# EAGLE design Sensor Circuit (EAGLE 9.3.0)
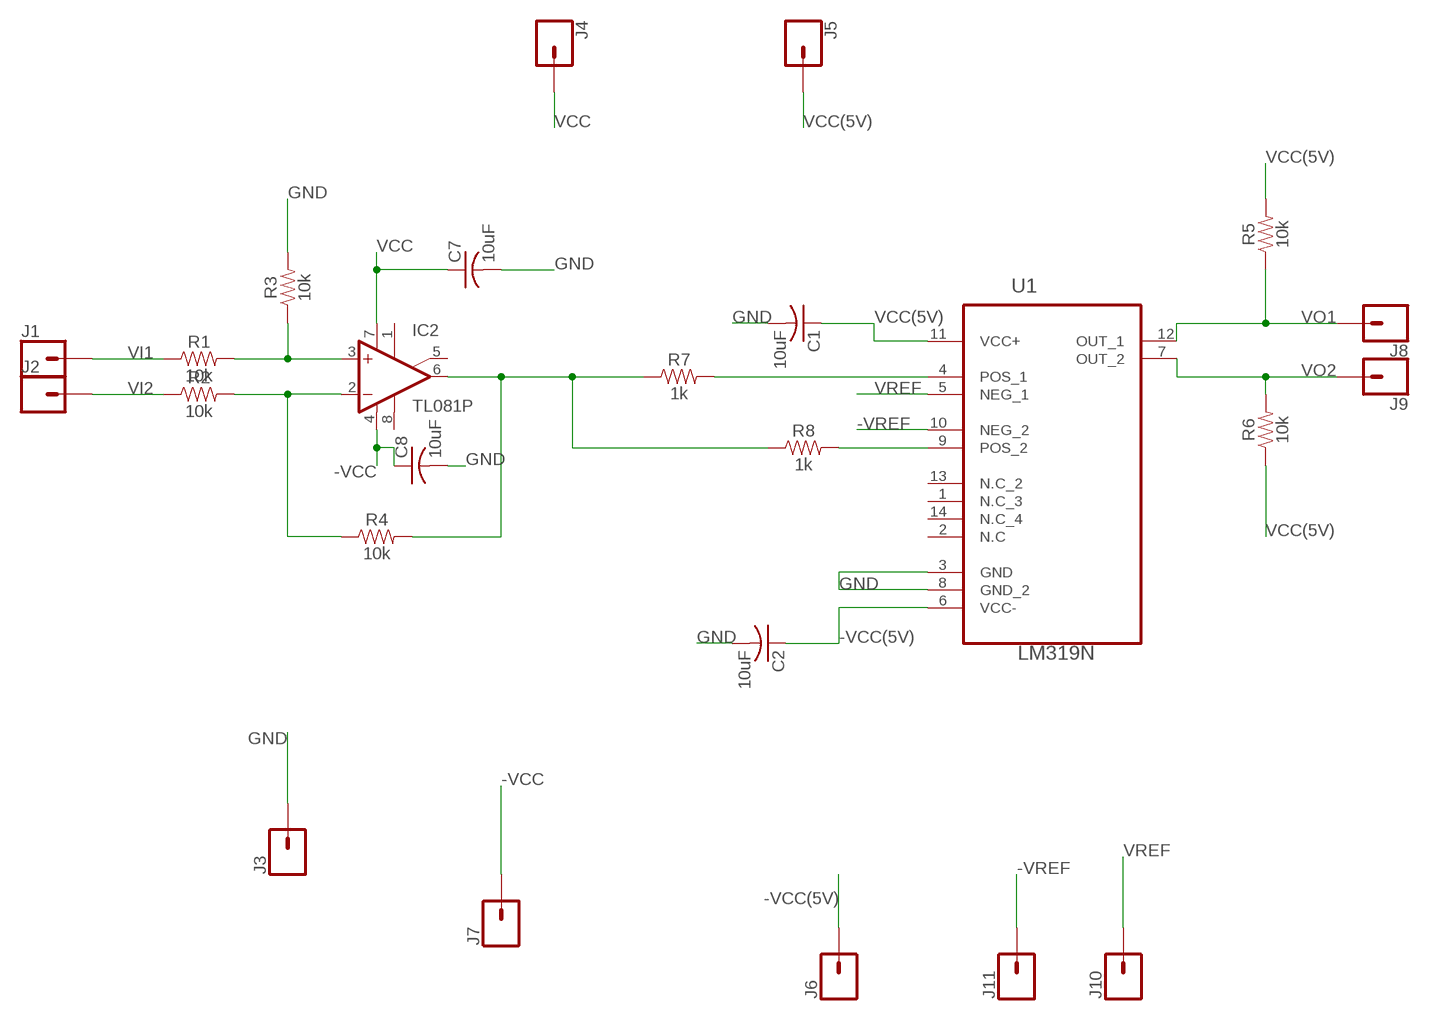
[diagram p0: schematic, sheet 1]

## Parts
C1  10uF  C-US050-024X044  [C050-024X044]
C2  10uF  C-US050-024X044  [C050-024X044]
C7  10uF  C-US050-024X044  [C050-024X044]
C8  10uF  C-US050-024X044  [C050-024X044]
IC2  TL081P  [DIL08]
J1  CONN_01  [1X01]
J2  CONN_01  [1X01]
J3  CONN_01  [1X01]
J4  CONN_01  [1X01]
J5  CONN_01  [1X01]
J6  CONN_01  [1X01]
J7  CONN_01  [1X01]
J8  CONN_01  [1X01]
J9  CONN_01  [1X01]
J10  CONN_01  [1X01]
J11  CONN_01  [1X01]
R1  10k  10KOHM-HORIZ-1/4W-1%  [AXIAL-0.3]
R2  10k  10KOHM-HORIZ-1/4W-1%  [AXIAL-0.3]
R3  10k  10KOHM-HORIZ-1/4W-1%  [AXIAL-0.3]
R4  10k  10KOHM-HORIZ-1/4W-1%  [AXIAL-0.3]
R5  10k  10KOHM-HORIZ-1/4W-1%  [AXIAL-0.3]
R6  10k  10KOHM-HORIZ-1/4W-1%  [AXIAL-0.3]
R7  1k  1KOHM-HORIZ-1/4W-1%  [AXIAL-0.3]
R8  1k  1KOHM-HORIZ-1/4W-1%  [AXIAL-0.3]
U1  LM319N  [DIP254P762X510-14]

## Nets
-VCC: C8.1 IC2.4(V-) J7.1
-VCC(5V): C2.1 J6.1 U1.6(VCC-)
-VREF: J11.1 U1.10(NEG_2)
GND: C1.2 C2.2 C7.2 C8.2 J3.1 R3.P$2 U1.3(GND) U1.8(GND_2)
N$1: IC2.2(-IN) R2.P$2 R4.P$1
N$2: IC2.6(OUT) R4.P$2 R7.P$1 R8.P$1
N$3: IC2.3(+IN) R1.P$2 R3.P$1
N$4: R8.P$2 U1.9(POS_2)
N$6: R7.P$2 U1.4(POS_1)
VCC: C7.1 IC2.7(V+) J4.1
VCC(5V): C1.1 J5.1 R5.P$2 R6.P$1 U1.11(VCC+)
VI1: J1.1 R1.P$1
VI2: J2.1 R2.P$1
VO1: J8.1 R5.P$1 U1.12(OUT_1)
VO2: J9.1 R6.P$2 U1.7(OUT_2)
VREF: J10.1 U1.5(NEG_1)
Unconnected: IC2.1(ON1) IC2.5(ON2) IC2.8(OPT) U1.1(N.C_3) U1.2(N.C) U1.13(N.C_2) U1.14(N.C_4)

## Library data of the parts
C1 C2 C7 C8 = rcl:C-US: CAPACITOR, American symbol; SPICEPREFIX: C
IC2 = TL081:TL081: OP AMP; AVAILABILITY: Unavailable; DESCRIPTION: the tl08x jfet-input operational amplifier family is designed to offer a wider selection than any previously develope...; MF: Texas Instruments; MP: TL081; PACKAGE: None; PRICE: None
J1-J11 = SparkFun-Connectors:CONN_01: Single connection point. Often used as Generic Header-pin footprint for 0.1 inch spaced/style header connections On any of the 0.1 inch spaced packages, you can populate with these: Break Away Headers - Straight <https://www.sparkfun.com/products/116> (PRT-00116) Break Away Male Headers - Right Angle <https://www.sparkfun.com/products/553> (PRT-00553) Female Headers <https://www.sparkfun.com/products/115> (PRT-00115) Break Away Headers - Machine Pin <https://www.sparkfun.com/products/117> (PRT-00117) Break Away Female Headers - Swiss Machine Pin <https://www.sparkfun.com/products/743> (PRT-00743) This device is also useful as a general connection point to wire up your design to another part of your project. Our various solder wires solder well into these plated through hole pads. Hook-Up Wire - Assortment (Stranded, 22 AWG) <https://www.sparkfun.com/products/11375> (PRT-11375) Hook-Up Wire - Assortment (Solid Core, 22 AWG) <https://www.sparkfun.com/products/11367> (PRT-11367) View the entire wire category on our website here <https://www.sparkfun.com/categories/141> Special notes: SMTSO-256-ET is a "flush mount" nut for a 4-40 screw. We mostly use this on specialty testbeds; it is a nice way to connect hardware to your PCB at an adjustable hieght. Also note, the SNAP packages are for using a snappable style connector. We sell a baggie of snaps and they are also used on two LilyPad designs: Snap Assortment - 30 pack (male and female) <https://www.sparkfun.com/products/11347> (DEV-11347) LilyPad Arduino SimpleSnap <https://www.sparkfun.com/products/10941> (DEV-10941) LilyPad SimpleSnap Protoboard <https://www.sparkfun.com/products/10940> (DEV-10940)
R1-R6 = SparkFun-Resistors:10KOHM: 10kΩ resistor A resistor is a passive two-terminal electrical component that implements electrical resistance as a circuit element. Resistors act to reduce current flow, and, at the same time, act to lower voltage levels within circuits. - Wikipedia; PROD_ID: RES-12183
R7 R8 = SparkFun-Resistors:1KOHM: 1kΩ resistor A resistor is a passive two-terminal electrical component that implements electrical resistance as a circuit element. Resistors act to reduce current flow, and, at the same time, act to lower voltage levels within circuits. - Wikipedia; PROD_ID: RES-12182
U1 = LM319N:LM319N: High speed dual comparators; AVAILABILITY: Unavailable; DESCRIPTION: Comparator; fast; 80ns; 5÷36VDC; Channels: 2; THT; DIP14; MF: Texas Instruments; MP: LM319N/NOPB; PACKAGE: DIP-14 Texas Instruments; PRICE: None

## Board
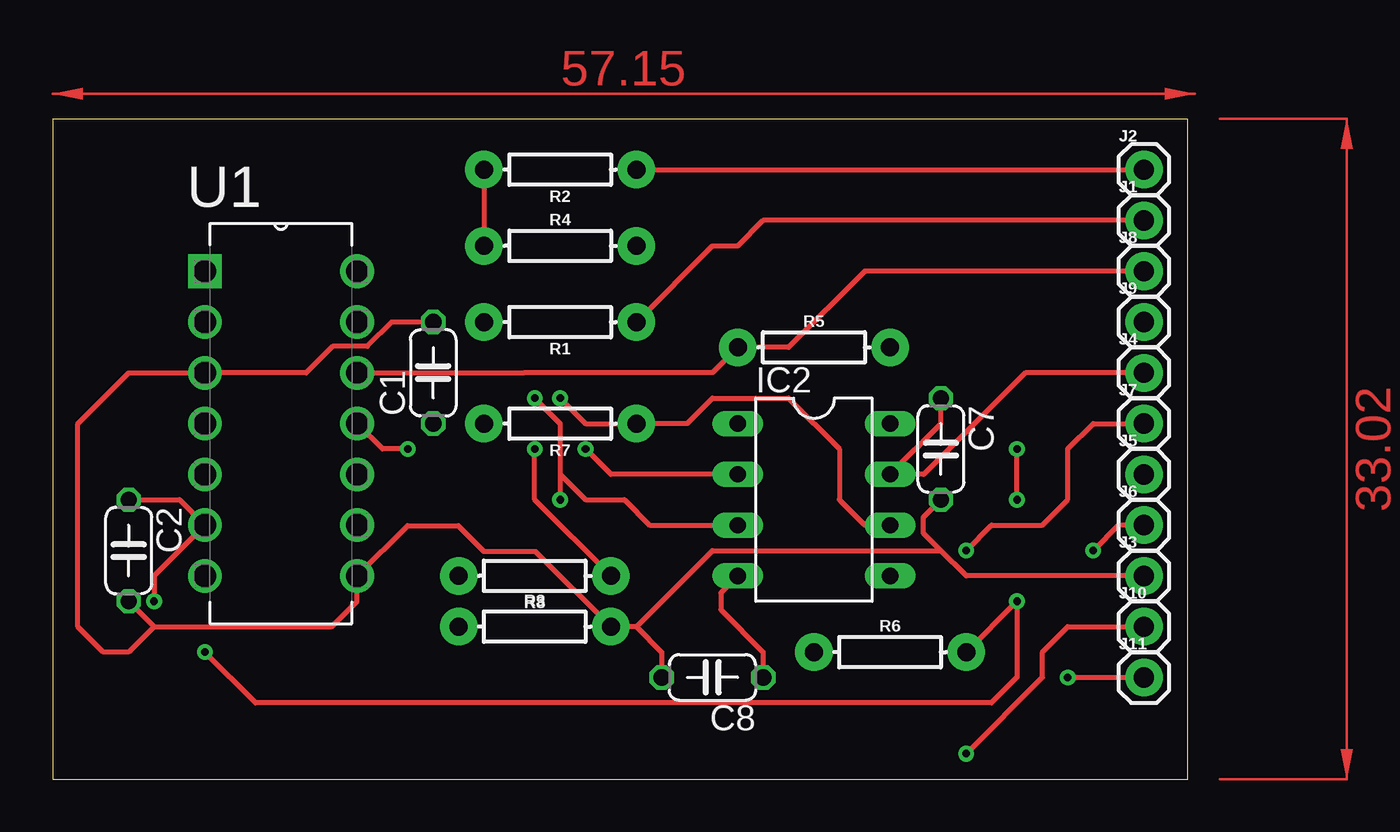
[diagram p1: board, top side]
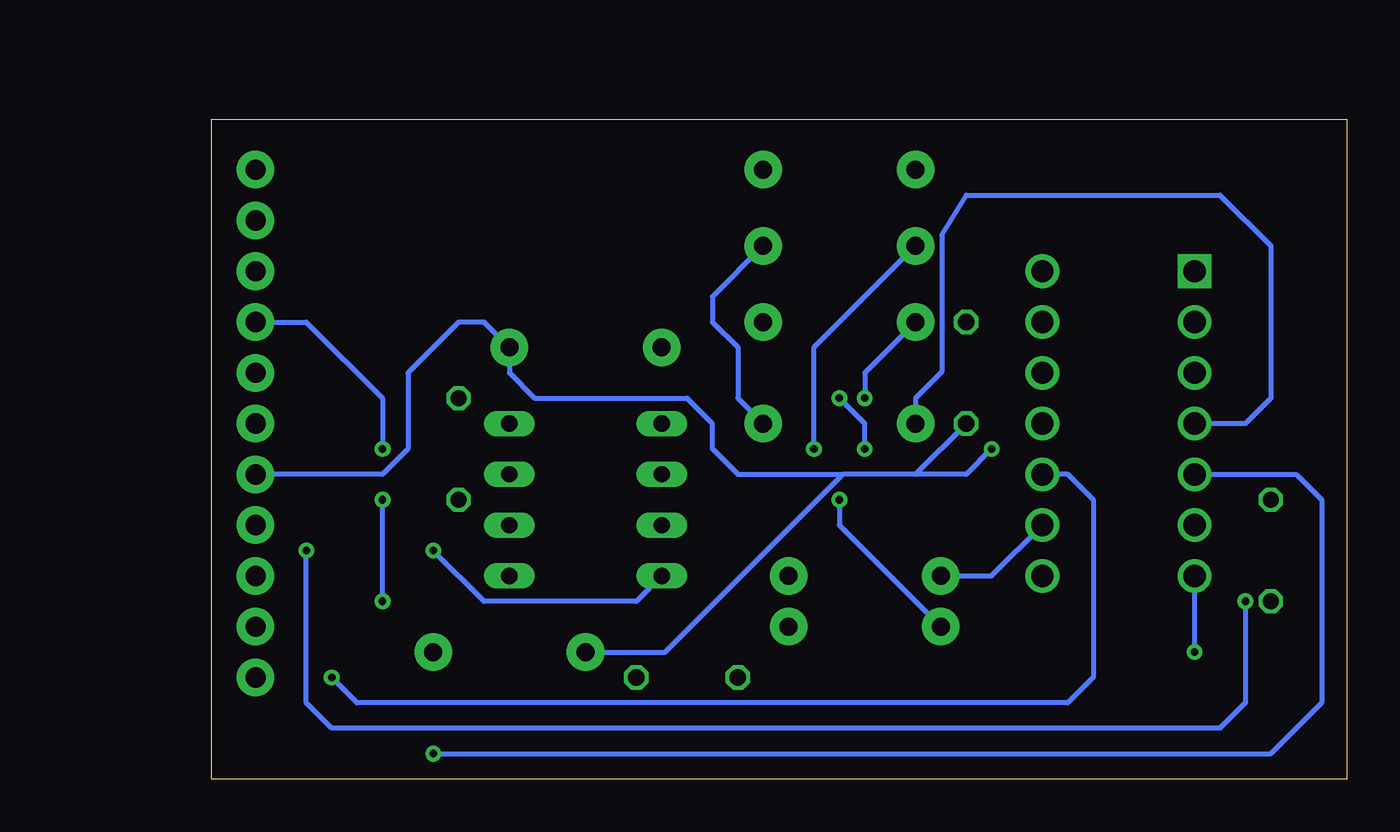
[diagram p2: board, bottom side, seen from below]

Size 56.82 x 33.01 mm. Coordinates in mm from the lower left corner, seen from the top.
Outline: 0,0 56.82,0 56.82,33.01 0,33.01 0,0
Copper layers (1*16): Top 0.035mm / dielectric 1.5mm / Bottom 0.035mm
Design rules "Standard": minimum track width 10mil, minimum drill 15mil, track to track 10mil, track to pad 10mil, pad to pad 10mil, via to via 10mil, smd to smd 10mil, copper to edge 20mil, drill to drill 10mil, minimum pad ring 8mil, minimum via ring 8mil, stop-mask expansion 4mil, vias tented up to drill 0mil, thermal gap 10mil

### Footprints (pad centres in the part's own frame; a part is rotated, then mirrored left to right if it is on the bottom)
C050-024X044 = drill 0.813 octagon: 1 -2.54,0; 2 2.54,0
DIL08 = drill 0.813 pad 1.27 long: 1 -3.81,-3.81; 2 -1.27,-3.81; 3 1.27,-3.81; 4 3.81,-3.81; 5 3.81,3.81; 6 1.27,3.81; 7 -1.27,3.81; 8 -3.81,3.81
1X01 = drill 1.016 pad 1.88: 1 0,0
AXIAL-0.3 = drill 0.9 pad 1.88: P$1 -3.81,0; P$2 3.81,0
DIP254P762X510-14 = drill 1.118 square: 1 -7.62,15.24 | drill 1.118: 2 -7.62,12.7; 3 -7.62,10.16; 4 -7.62,7.62; 5 -7.62,5.08; 6 -7.62,2.54; 7 -7.62,0; 8 0,0; 9 0,2.54; 10 0,5.08; 11 0,7.62; 12 0,10.16; 13 0,12.7; 14 0,15.24

### Placement (x,y rotation side)
C1  19.05,20.32 90 top
C2  3.81,11.43 270 top
C7  44.45,16.51 270 top
C8  33.02,5.08 180 top
IC2  38.1,13.97 270 top
J1  54.61,27.94 0 top
J2  54.61,30.48 0 top
J3  54.61,10.16 0 top
J4  54.61,20.32 0 top
J5  54.61,15.24 0 top
J6  54.61,12.7 0 top
J7  54.61,17.78 0 top
J8  54.61,25.4 0 top
J9  54.61,22.86 0 top
J10  54.61,7.62 0 top
J11  54.61,5.08 0 top
R1  25.4,22.86 180 top
R2  25.4,30.48 180 top
R3  24.13,7.62 0 top
R4  25.4,26.67 0 top
R5  38.1,21.59 0 top
R6  41.91,6.35 0 top
R7  25.4,17.78 180 top
R8  24.13,10.16 180 top
U1  15.24,10.16 0 top

### Tracks (layer width: path | path; a pad name or v marks a point on that pad's centre or on a via)
-VCC  (via drill 0.38)
  Top 0.254: J7.1 52.07,17.78 50.8,16.51 50.8,13.97 49.53,12.7 46.99,12.7 v45.72,11.43 | IC2.4 33.44,9.31 33.44,8.47 35.56,6.35 C8.1
  Bottom 0.254: IC2.4 35.56,8.89 43.18,8.89 v45.72,11.43
-VCC(5V)  (via drill 0.38)
  Top 0.254: v5.08,8.89 5.08,10.16 U1.6 6.35,13.97 C2.1 | J6.1 53.34,12.7 v52.07,11.43
  Bottom 0.254: v52.07,11.43 52.07,3.81 50.8,2.54 6.35,2.54 5.08,3.81 v5.08,8.89
-VREF  (via drill 0.38)
  Top 0.254: v50.8,5.08 J11.1
  Bottom 0.254: U1.10 13.97,15.24 12.7,13.97 12.7,5.08 13.97,3.81 49.53,3.81 v50.8,5.08
GND
  Top 0.254: 5.08,7.62 13.97,7.62 15.24,8.89 U1.8 17.75,12.68 20.29,12.68 21.59,11.38 24.18,11.38 R3.P$2 29.21,7.62 | 44.45,11.43 45.72,10.16 J3.1 | 44.45,11.43 33.02,11.43 29.21,7.62 | 5.08,7.62 3.81,6.35 2.54,6.35 1.27,7.62 1.27,17.78 3.81,20.32 U1.3 12.7,20.32 14.02,21.64 15.75,21.64 16.96,22.86 C1.2 | 29.21,7.62 30.48,6.35 C8.2 | C7.2 43.56,13.08 43.56,12.32 44.45,11.43 | C2.2 5.08,7.62
N$1  (via drill 0.38)
  Top 0.254: R2.P$2 R4.P$1 | IC2.2 27.94,15.24 v26.67,16.51
  Bottom 0.254: R4.P$1 26.67,21.59 v26.67,16.51
N$2  (via drill 0.38)
  Top 0.254: IC2.6 40.64,12.7 39.37,13.97 39.37,16.51 36.83,19.05 33.02,19.05 31.75,17.78 R7.P$1 26.67,17.78 v25.4,19.05 | R8.P$1 24.13,13.97 v24.13,16.51
  Bottom 0.254: R4.P$2 31.75,24.13 31.75,22.86 30.48,21.59 30.48,19.05 R7.P$1 | v24.13,16.51 24.13,17.78 v25.4,19.05
N$3  (via drill 0.38)
  Top 0.254: v24.13,19.05 25.4,17.78 25.4,15.24 | IC2.3 29.88,12.7 28.61,13.97 26.67,13.97 25.4,15.24 | 25.4,15.24 v25.4,13.97
  Bottom 0.254: R1.P$2 24.13,20.32 v24.13,19.05 | v25.4,13.97 25.4,12.7 R3.P$1
N$4
  Bottom 0.254: R8.P$2 17.78,10.16 U1.9
N$6
  Bottom 0.254: R7.P$2 21.59,19.05 20.27,20.37 20.27,27.22 19.05,29.21 6.35,29.21 3.81,26.67 3.81,19.05 5.08,17.78 U1.4
VCC
  Top 0.254: J4.1 48.68,20.32 43.6,15.24 IC2.7 44.45,17.78 C7.1
VCC(5V)  (via drill 0.38)
  Top 0.254: v17.78,16.51 16.51,16.51 U1.11
  Bottom 0.254: J5.1 48.26,15.24 46.99,16.51 46.99,20.32 44.45,22.86 43.18,22.86 R5.P$2 41.91,20.32 40.64,19.05 33.02,19.05 31.75,17.78 31.75,16.51 30.48,15.24 25.23,15.24 | v17.78,16.51 19.05,15.24 21.59,15.24 | 25.23,15.24 29.26,11.2 34.12,6.35 R6.P$1 | 21.59,15.24 25.23,15.24 | C1.1 21.59,15.24
VI1
  Top 0.254: J1.1 35.56,27.94 34.29,26.67 33.02,26.67 R1.P$1
VI2
  Top 0.254: R2.P$1 J2.1
VO1
  Top 0.254: U1.12 23.59,20.32 23.6,20.33 33.03,20.33 R5.P$1 36.83,21.59 40.64,25.4 J8.1
VO2  (via drill 0.38)
  Top 0.254: v7.62,6.35 10.16,3.81 46.99,3.81 48.26,5.08 v48.26,8.89 R6.P$2 | v48.26,13.97 v48.26,16.51
  Bottom 0.254: v7.62,6.35 U1.7 | v48.26,8.89 v48.26,13.97 | J9.1 52.07,22.86 48.26,19.05 v48.26,16.51
VREF  (via drill 0.38)
  Top 0.254: v45.72,1.27 49.53,5.08 49.53,6.35 50.8,7.62 J10.1
  Bottom 0.254: U1.5 2.54,15.24 1.27,13.97 1.27,3.81 3.81,1.27 v45.72,1.27
(copper drawn outside any net)
  shapes: Top area x2